# Altium schematic sheet GPS.SchDoc
size A3
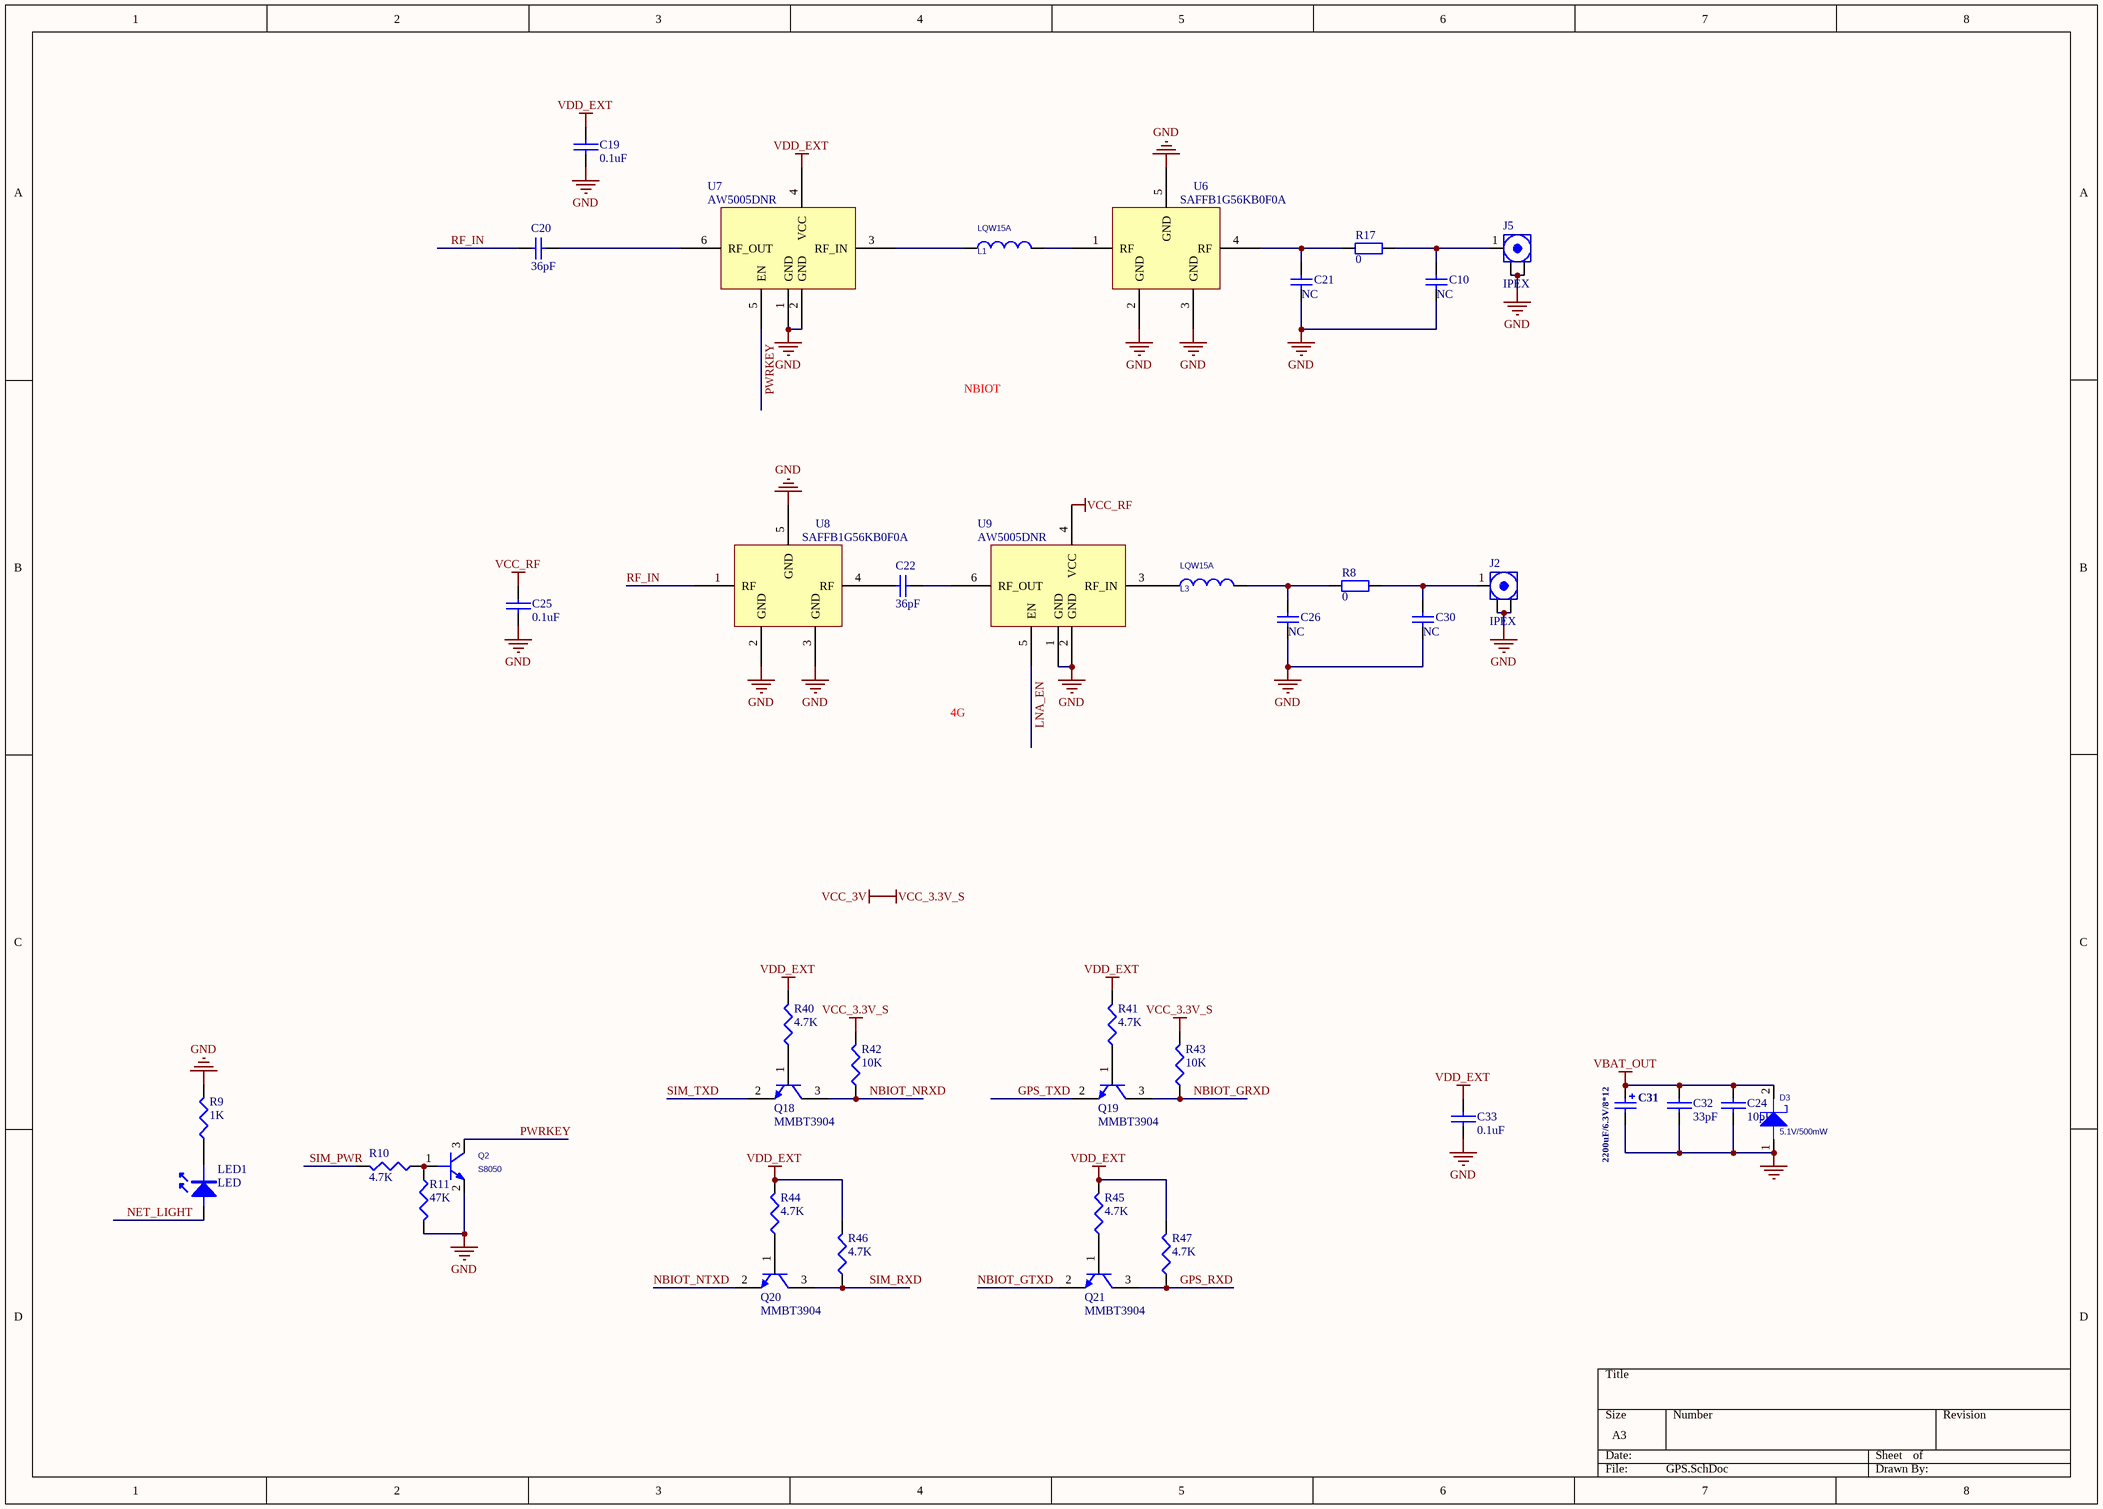
[diagram p0: GPS.SchDoc]

## Parts
C10  NC  [0603C]
C19  0.1uF  [0603C]
C20  36pF  [0603C]
C21  NC  [0603C]
C22  36pF  [0603C]
C24  10pF  [0603C]
C25  0.1uF  [0603C]
C26  NC  [0603C]
C30  NC  [0603C]
C31  2200uF/6.3V/8*12  [8*12]
C32  33pF  [0603C]
C33  0.1uF  [0603C]
D3  value 5.1V/500mW  [LL-34(D1206)]  (hidden comment: DIODE_SCHOTTKY_0)
J2  IPEX  [RF-UFL]
J5  IPEX  [RF-UFL]
L1  LQW15A  [0402R]
L3  LQW15A  [0402R]
LED1  LED  [0603LED]
Q2  S8050  [SOT23]
Q18  MMBT3904  [SOT23-3]
Q19  MMBT3904  [SOT23-3]
Q20  MMBT3904  [SOT23-3]
Q21  MMBT3904  [SOT23-3]
R8  0  [0603R]
R9  1K  [0603R]
R10  4.7K  [0603R]
R11  47K  [0603R]
R17  0  [0603R]
R40  4.7K  [0603R]
R41  4.7K  [0603R]
R42  10K  [0603R]
R43  10K  [0603R]
R44  4.7K  [0603R]
R45  4.7K  [0603R]
R46  4.7K  [0603R]
R47  4.7K  [0603R]
U6  SAFFB1G56KB0F0A  [SAFFB1G56KB0F0A]
U7  AW5005DNR
U8  SAFFB1G56KB0F0A  [SAFFB1G56KB0F0A]
U9  AW5005DNR

## Nets
GND: C10.2 C19.1 C21.2 C24.1 C25.1 C26.2 C30.2 C31.2 C32.1 C33.1 D3.1 J2.2(Y) J5.2(Y) Q2.2(E) R9.2 R11.2 U6.2(GND) U6.3(GND) U6.5(GND) U7.1(GND) U7.2(GND) U8.2(GND) U8.3(GND) U8.5(GND) U9.1(GND) U9.2(GND)
VBAT_OUT: C24.2 C31.1 C32.2 D3.2
VCC_3.3V_S: R42.2 R43.2  [also labelled VCC_3V]
VCC_RF: C25.2 U9.4(VCC)
VDD_EXT: C19.2 C33.2 R40.2 R41.2 R44.2 R45.2 R46.2 R47.2 U7.4(VCC)
GPS_RXD: Q21.3(C) R47.1
GPS_TXD: Q19.2(E)
LNA_EN: U9.5(EN)
NBIOT_GRXD: Q19.3(C) R43.1
NBIOT_GTXD: Q21.2(E)
NBIOT_NRXD: Q18.3(C) R42.1
NBIOT_NTXD: Q20.2(E)
NET_LIGHT: LED1.1
PWRKEY: Q2.3(C) U7.5(EN)
RF_IN: C20.1 U8.1(RF)
SIM_PWR: R10.2
SIM_RXD: Q20.3(C) R46.1
SIM_TXD: Q18.2(E)
NetC10_1: C10.1 J5.1(X) R17.2
NetC20_2: C20.2 U7.6(RF_OUT)
NetC21_1: C21.1 R17.1 U6.4(RF)
NetC22_1: C22.1 U8.4(RF)
NetC22_2: C22.2 U9.6(RF_OUT)
NetC26_1: C26.1 L3.2 R8.1
NetC30_1: C30.1 J2.1(X) R8.2
NetL1_1: L1.1 U7.3(RF_IN)
NetL1_2: L1.2 U6.1(RF)
NetL3_1: L3.1 U9.3(RF_IN)
NetLED1_2: LED1.2 R9.1
NetQ2_1: Q2.1(B) R10.1 R11.1
NetQ18_1: Q18.1(B) R40.1
NetQ19_1: Q19.1(B) R41.1
NetQ20_1: Q20.1(B) R44.1
NetQ21_1: Q21.1(B) R45.1

## Notes on the sheet
- NBIOT
- 4G

## Library data of the parts
C10 C20-C22 C26 C30 = Cap: Capacitor; Value: 0.1uF/10V; Published: 8-Jun-2000; LatestRevisionDate: 17-Jul-2002; LatestRevisionNote: Re-released for DXP Platform.; PackageReference: RAD-0.3; Publisher: Altium Limited
C19 C24 C25 C32 C33 = CAP: Capacitor
C31 = Cap Pol3: Polarized Capacitor (Surface Mount); PackageReference: C10*10.2
D3 = DIODE_SCHOTTKY_0: PCB DECAL: DO_214AC; Source_Path: E:\AIH\WORK\A\LIBRARY1.OLB
J2 J5 = ANT
L1 L3 = INDUCTOR_1
Q2 = 2N1069_1: PspiceTemplate: Q^@REFDES %C %B %E
Q18-Q21 = NPN
R8 R17 = Res2: Resistor; Published: 8-Jun-2000; LatestRevisionDate: 17-Jul-2002; LatestRevisionNote: Re-released for DXP Platform.; PackageReference: AXIAL-0.4; Publisher: Altium Limited; Value: 0
R9-R11 R40-R47 = RES1: P: 1/8W
U6 U8 = SAFFB1G56KBOFA